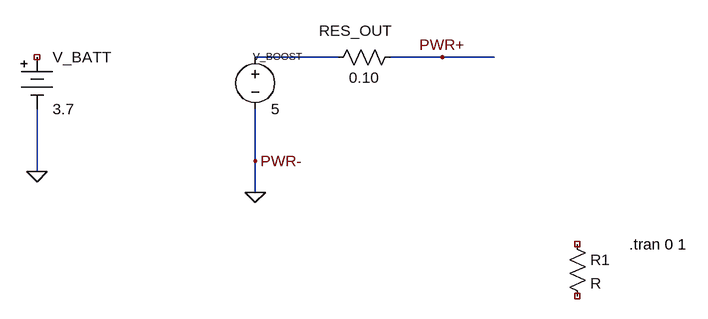
[diagram p0: schematic power_bank.asc]
power_bank.asc, the LTspice schematic file:
Version 4.1
SHEET 1 880 680
WIRE 304 128 176 128
WIRE 464 128 384 128
WIRE 544 128 464 128
WIRE 176 288 176 208
WIRE -160 304 -160 208
WIRE 176 336 176 288
FLAG 176 336 0
FLAG 464 128 PWR+
FLAG 176 288 PWR-
FLAG -160 304 0
SYMBOL Misc\\battery -160 112 R0
SYMATTR InstName V_BATT
SYMATTR Value 3.7
SYMBOL voltage 176 112 R0
WINDOW 0 34 25 Bottom 1
SYMATTR InstName V_BOOST
SYMATTR Value 5
SYMBOL res 400 112 R90
WINDOW 0 -9 69 VBottom 2
WINDOW 3 32 56 VTop 2
SYMATTR InstName RES_OUT
SYMATTR Value 0.10
SYMBOL res 656 400 R0
SYMATTR InstName R1
TEXT 752 416 Left 2 !.tran 0 1

The netlist it stands for:
* power_bank.asc
V_BATT NC_01 0 3.7
V_BOOST N001 0 5
RES_OUT PWR+ N001 0.10
R1 NC_02 NC_03 R
.tran 0 1
.backanno
.end